# EAGLE design musIR-tiny-mk-1.0.1 (EAGLE 7.5.0)
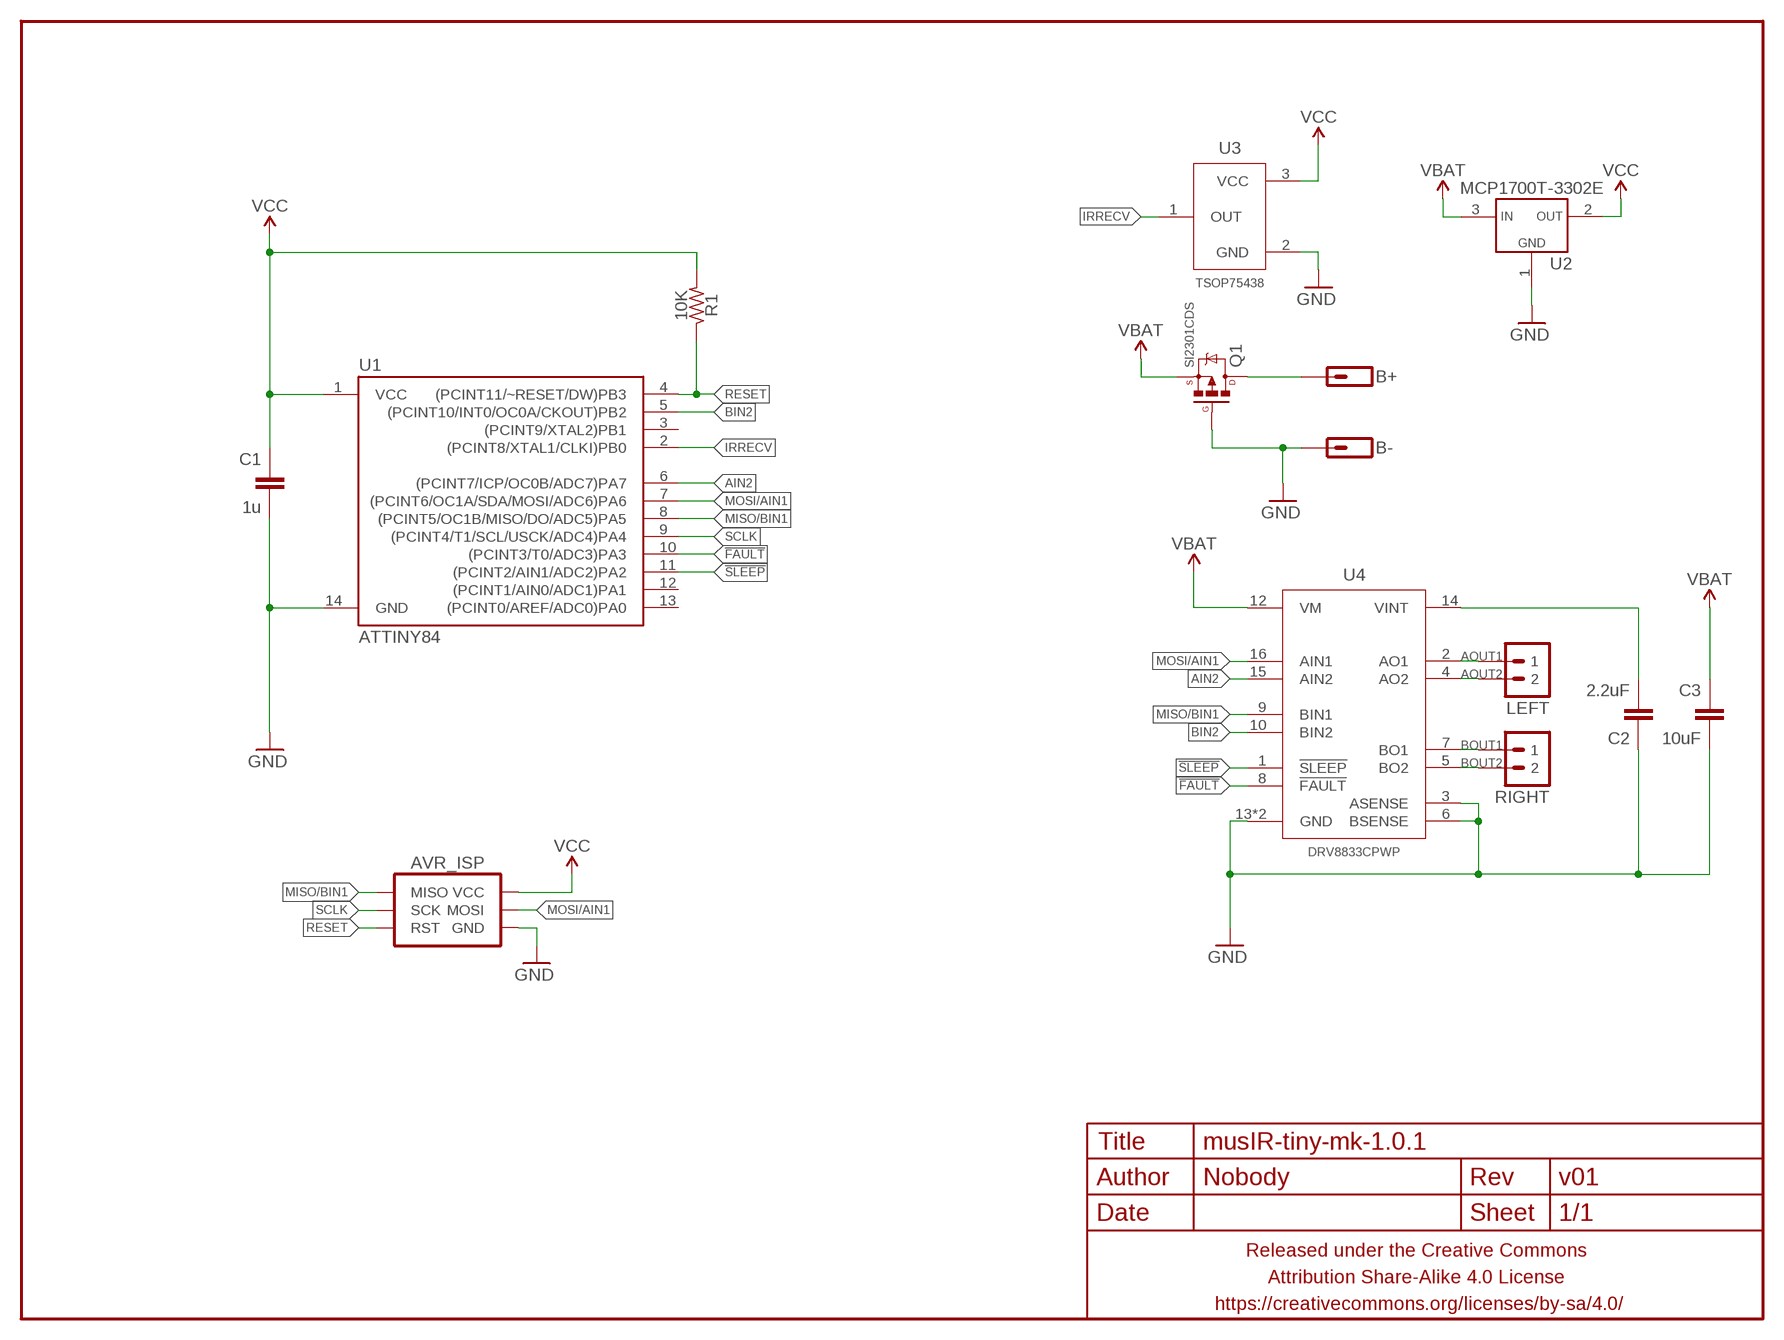
[diagram p0: schematic, sheet 1]

## Parts
AVR_ISP  AVR_SPI_PRG_6TESTPOINTS  [2X3_TEST_POINTS]
B+  M01PTH  [1X01]
B-  M01PTH  [1X01]
C1  1u  CAPACITOR-CERAMICC0603-TIGHTER  [C0603-TIGHTER]
C2  2.2uF  CAPACITOR-CERAMICC0603-TIGHTER  [C0603-TIGHTER]
C3  10uF  CAPACITOR-CERAMICC0805-TIGHTER  [C0805-TIGHTER]
FRAME1  FRAME-LETTERNO_PACKAGE  [DUMMY]
LEFT  M02PTH-CENTERED  [1X02-CENTER]
Q1  SI2301CDS  MOSFET-PCHANNELSOT-23  [SOT23]
R1  10K  RESISTORR0402  [R0402]
RIGHT  M02PTH-CENTERED  [1X02-CENTER]
U1  ATTINY84  [SO14]
U2  MCP1700T-3302E  MCP1700SOT-23-3  [SOT23-3]
U3  TSOP75438  TSOP382__/4__  [TSOP38238]
U4  DRV8833CPWP  [TSSOP-16-PAD]

## Nets
!FAULT: U1.10((PCINT3/T0/ADC3)PA3) U4.8(!FAULT)
!SLEEP: U1.11((PCINT2/AIN1/ADC2)PA2) U4.1(!SLEEP)
AIN2: U1.6((PCINT7/ICP/OC0B/ADC7)PA7) U4.15(AIN2)
AOUT1: LEFT.1 U4.2(AO1)
AOUT2: LEFT.2 U4.4(AO2)
BIN2: U1.5((PCINT10/INT0/OC0A/CKOUT)PB2) U4.10(BIN2)
BOUT1: RIGHT.1 U4.7(BO1)
BOUT2: RIGHT.2 U4.5(BO2)
GND: AVR_ISP.6(GND) B-.1 C1.2 C2.1 C3.2 Q1.1(G) U1.14(GND) U2.1(GND) U3.2(GND) U4.3(ASENSE) U4.6(BSENSE) U4.13(GND) U4.PAD(GND)
IRRECV: U1.2((PCINT8/XTAL1/CLKI)PB0) U3.1(OUT)
MISO/BIN1: AVR_ISP.1(MISO) U1.8((PCINT5/OC1B/MISO/DO/ADC5)PA5) U4.9(BIN1)
MOSI/AIN1: AVR_ISP.4(MOSI) U1.7((PCINT6/OC1A/SDA/MOSI/ADC6)PA6) U4.16(AIN1)
N$1: B+.1 Q1.3(D)
N$4: C2.2 U4.14(VINT)
RESET: AVR_ISP.5(RST) R1.1 U1.4((PCINT11/~RESET/DW)PB3)
SCLK: AVR_ISP.3(SCK) U1.9((PCINT4/T1/SCL/USCK/ADC4)PA4)
VBAT: C3.1 Q1.2(S) U2.3(VIN) U4.12(VM)
VCC: AVR_ISP.2(VCC) C1.1 R1.2 U1.1(VCC) U2.2(VOUT) U3.3(VCC)
Unconnected: U1.3((PCINT9/XTAL2)PB1) U1.12((PCINT1/AIN0/ADC1)PA1) U1.13((PCINT0/AREF/ADC0)PA0)

## Library data of the parts
AVR_ISP = a_parts:AVR_SPI_PRG_6: AVR ISP 6 Pin This is the reduced ISP connector for AVR programming. Common on Arduino. This footprint will take up less PCB space and can be used with a 10-pin to 6-pin adapter such as SKU: BOB-08508 **Special note about "TEST_POINT" package. The stop mask is on the top side, so if you want your programming test points to be on the bottom of your board, make sure to place this package on the bottom side of the board. This also ensure that the orientation to program from the bottom side will be correct.
B+ B- = a_parts:M01: Header 1 Standard 1-pin 0.1" header. Use with straight break away headers (SKU : PRT-00116), right angle break away headers (PRT-00553), swiss pins (PRT-00743), machine pins (PRT-00117), and female headers (PRT-00115).
C1-C3 = a_parts:CAPACITOR-CERAMIC: CAPACITOR, European symbol
FRAME1 = a_parts:FRAME-LETTER: Schematic Frame Standard 8.5x11 US Letter frame; DESIGNER: Nobody; VERSION: v01
LEFT RIGHT = a_parts:M02: Standard 2-pin 0.1" header. Use with - straight break away headers ( PRT-00116) - right angle break away headers (PRT-00553) - swiss pins (PRT-00743) - machine pins (PRT-00117) - female headers (PRT-00115) Molex polarized connector foot print use with: PRT-08233 with associated crimp pins and housings. 2.54_SCREWTERM for use with PRT-10571. 3.5mm Screw Terminal footprints for PRT-08084 5mm Screw Terminal footprints for use with PRT-08433
Q1 = a_parts:MOSFET-PCHANNEL: Generic PMOSFET IRLML2244 - TRANS-11153 (SOT-23 -20V -4.3A) (1.Gate 2.Source 3.Drain) FQP27P06 - COM-10349 <http://www.sparkfun.com/products/10349> (TO-220 -60V -27A) (1.Gate 2.Source 3.Drain)
R1 = a_parts:RESISTOR: RESISTOR, American symbol
U1 = a_parts:ATTINY84: Atmel 14-pin 2/4/8kB flash uC
U2 = a_parts:MCP1700
U3 = a_parts:TSOP382__/4__
U4 = a_parts:DRV8833C

## Board
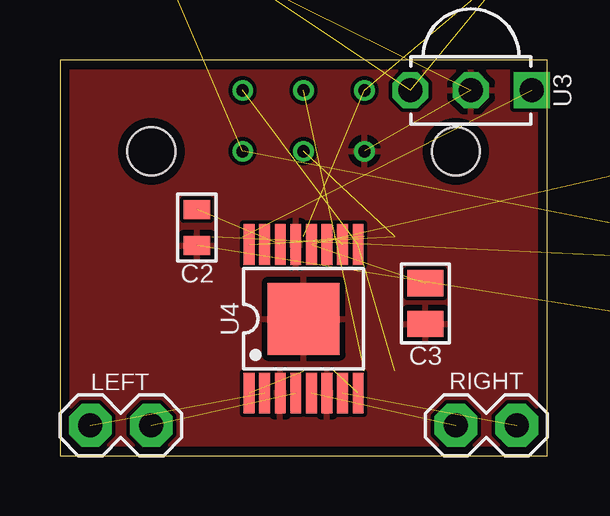
[diagram p1: board, top side]
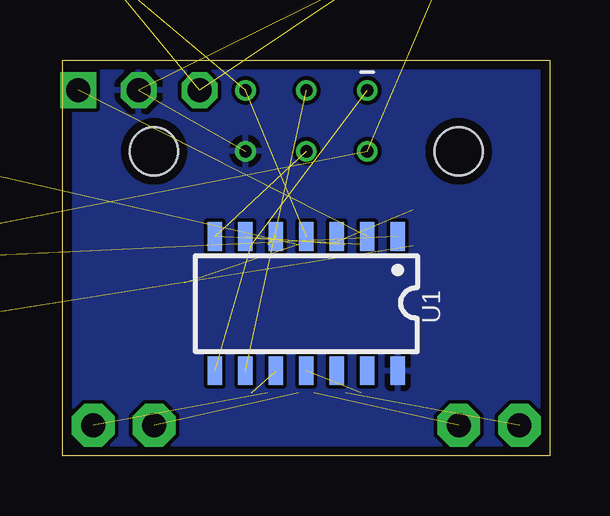
[diagram p2: board, bottom side, seen from below]

Size 20.32 x 16.51 mm. Coordinates in mm from the lower left corner, seen from the top.
Outline: 0,0 20.32,0 20.32,16.51 0,16.51 0,0
Copper layers (1*16): Top 0.0356mm / dielectric 1.5011mm / Bottom 0.0356mm
Design rules "LaenPCBOrder2": minimum track width 6mil, minimum drill 13mil, track to track 6mil, track to pad 6mil, pad to pad 6mil, via to via 6mil, smd to smd 6mil, copper to edge 15mil, drill to drill 6mil, minimum pad ring 7mil, minimum via ring 7mil, stop-mask expansion 3mil, vias tented up to drill 20mil, thermal gap 10mil
Holes 2 mm at 3.81,12.7 16.51,12.7

### Footprints (pad centres in the part's own frame; a part is rotated, then mirrored left to right if it is on the bottom)
2X3_TEST_POINTS = drill 0.508: 1 -2.54,-1.27; 2 -2.54,1.27; 3 0,-1.27; 4 0,1.27; 5 2.54,-1.27; 6 2.54,1.27
1X01 = drill 1 pad 1.778 octagon: 1 0,0
C0603-TIGHTER = smd 0.8 x 1.1: 1 -0.75,0; 2 0.75,0
C0805-TIGHTER = smd 1.1 x 1.5: 1 -0.85,0; 2 0.85,0
1X02-CENTER = drill 1 pad 1.778 octagon: 1 -1.27,0; 2 1.27,0
SOT23 = smd 1 x 1.2: 1 -0.95,-1; 2 0.95,-1; 3 0,1
R0402 = smd 0.6 x 0.7: 1 -0.5,0; 2 0.5,0
SO14 = smd 0.6 x 1.2: 1 -3.81,-2.8; 2 -2.54,-2.8; 3 -1.27,-2.8; 4 0,-2.8; 5 1.27,-2.8; 6 2.54,-2.8; 7 3.81,-2.8; 8 3.81,2.8; 9 2.54,2.8; 10 1.27,2.8; 11 0,2.8; 12 -1.27,2.8; 13 -2.54,2.8; 14 -3.81,2.8
SOT23-3 = smd 0.8 x 0.9: 1 -0.95,-1; 2 0.95,-1; 3 0,1.1
TSOP38238 = drill 1 square: 1 -2.54,0 | drill 1 octagon: 2 0,0; 3 2.54,0
TSSOP-16-PAD = smd 0.45 x 1.7: 1 -2.275,-3.1; 2 -1.625,-3.1; 3 -0.975,-3.1; 4 -0.325,-3.1; 5 0.325,-3.1; 6 0.975,-3.1; 7 1.625,-3.1; 8 2.275,-3.1; 9 2.275,3.1; 10 1.625,3.1; 11 0.975,3.1; 12 0.325,3.1; 13 -0.325,3.1; 14 -0.975,3.1; 15 -1.625,3.1; 16 -2.275,3.1 | smd 3 x 3: PAD 0,0

### Placement (x,y rotation side)
AVR_ISP  10.16,13.97 180 bottom
B+  27.3,10.54 270 top  (outside the outline)
B-  27.3,5.33 90 top  (outside the outline)
C1  2.54,22.86 180 top  (outside the outline)
C2  5.71,9.53 90 top
C3  15.24,6.35 270 top
FRAME1  0,0 0 top
LEFT  2.54,1.27 0 top
Q1  30.1,14.48 270 bottom  (outside the outline)
R1  21.59,23.24 90 top  (outside the outline)
RIGHT  17.78,1.27 180 top
U1  10.16,6.35 180 bottom
U2  30.99,8.89 270 bottom  (outside the outline)
U3  17.14,15.24 180 top
U4  10.16,5.71 0 top

### Tracks (layer width: path | path; a pad name or v marks a point on that pad's centre or on a via)
!FAULT  (1 unrouted)
!SLEEP  (1 unrouted)
AIN2  (1 unrouted)
AOUT1  (1 unrouted)
AOUT2  (1 unrouted)
BIN2  (1 unrouted)
BOUT1  (1 unrouted)
BOUT2  (1 unrouted)
GND  (3 unrouted)
  pour Top (rank 6): 0,0 20.32,0 20.32,16.51 0,16.51
  pour Bottom (rank 6): 0,0 20.32,0 20.32,16.51 0,16.51
IRRECV  (1 unrouted)
MISO/BIN1  (2 unrouted)
MOSI/AIN1  (2 unrouted)
N$1  (1 unrouted)
N$4  (1 unrouted)
RESET  (2 unrouted)
SCLK  (1 unrouted)
VBAT  (3 unrouted)
VCC  (5 unrouted)